# Altium project RK_NVR_DEMO1_RK3588_LP4XD200P232SD8_V21_20211228.PrjPcb (part 12 of 19)

## Sheet 55.VO-HDMI1.4 TX(MIPI to HDMI).SchDoc
size 420 x 297 mm; Revision: V2.1; Schematic Page Number: 11; Page Number: 30; Check: Default; Schematic Name: RK_NVR_DEMO1_RK3588_LP4/4x_V21; Page Count: 43; Page name: 55.VO-HDMI1.4 TX(MIPI to HDMI); Designer: Zhangdz; Schematic Page Count: 99; Revcode: V2.1; DsnPath: E:\Work\SBER\RK3588_SOM\temp\RK_NVR_DEMO1_RK3588_LP4XD200P232SD8_V21_20211228.DSN; SchematicName: RK_NVR_DEMO1_RK3588_LP4/4x_V21; PageName: 55.VO-HDMI1.4 TX(MIPI to HDMI); PageSize: A3; TopSchematic: True
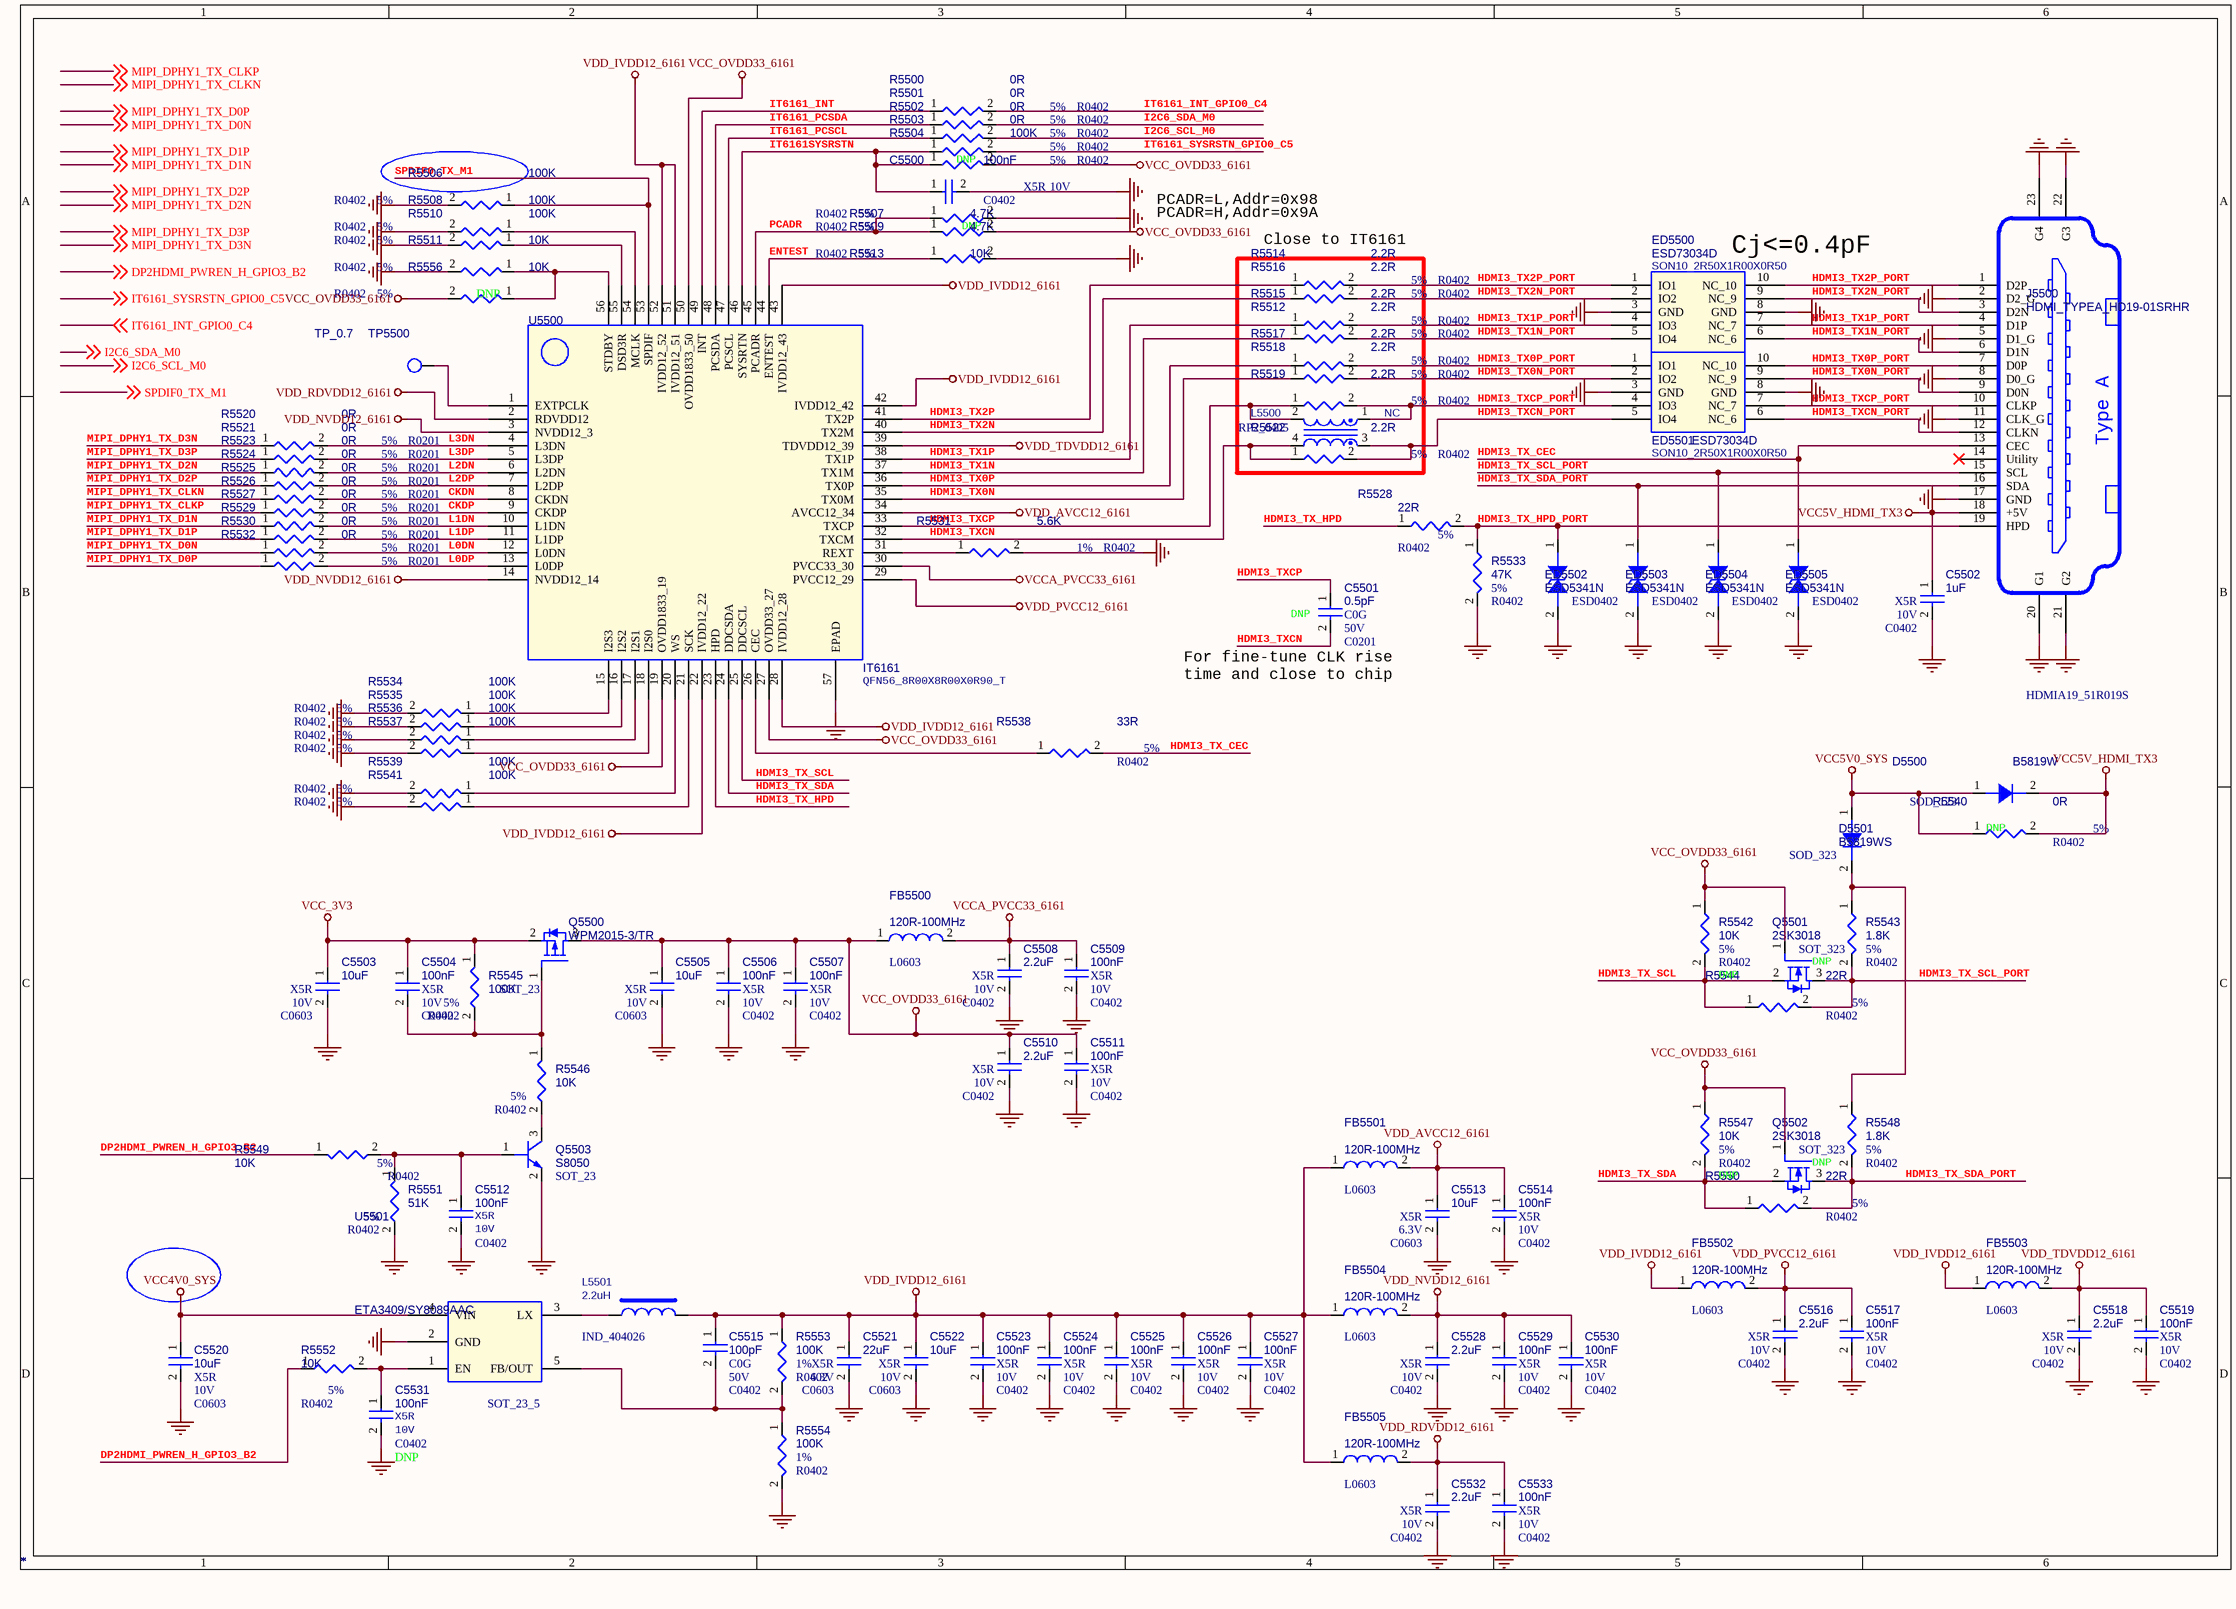
[diagram p57: 55.VO-HDMI1.4 TX(MIPI to HDMI).SchDoc]

### Parts
C5500  *  Voltage: 10V  Dielectric: X5R  [C0402]
C5501  *  Voltage: 50V  Dielectric: C0G  Option: DNP  [C0201]
C5502  *  Voltage: 10V  Dielectric: X5R  [C0402]
C5503  *  Voltage: 10V  Dielectric: X5R  [C0603]
C5504  *  Voltage: 10V  Dielectric: X5R  [C0402]
C5505  *  Voltage: 10V  Dielectric: X5R  [C0603]
C5506  *  Voltage: 10V  Dielectric: X5R  [C0402]
C5507  *  Voltage: 10V  Dielectric: X5R  [C0402]
C5508  *  Voltage: 10V  Dielectric: X5R  [C0402]
C5509  *  Voltage: 10V  Dielectric: X5R  [C0402]
C5510  *  Voltage: 10V  Dielectric: X5R  [C0402]
C5511  *  Voltage: 10V  Dielectric: X5R  [C0402]
C5512  *  Voltage: 10V  Dielectric: X5R  [C0402]
C5513  *  Voltage: 6.3V  Dielectric: X5R  [C0603]
C5514  *  Voltage: 10V  Dielectric: X5R  [C0402]
C5515  *  Voltage: 50V  Dielectric: C0G  [C0402]
C5516  *  Voltage: 10V  Dielectric: X5R  [C0402]
C5517  *  Voltage: 10V  Dielectric: X5R  [C0402]
C5518  *  Voltage: 10V  Dielectric: X5R  [C0402]
C5519  *  Voltage: 10V  Dielectric: X5R  [C0402]
C5520  *  Voltage: 10V  Dielectric: X5R  [C0603]
C5521  *  Voltage: 6.3V  Dielectric: X5R  [C0603]
C5522  *  Voltage: 10V  Dielectric: X5R  [C0603]
C5523  *  Voltage: 10V  Dielectric: X5R  [C0402]
C5524  *  Voltage: 10V  Dielectric: X5R  [C0402]
C5525  *  Voltage: 10V  Dielectric: X5R  [C0402]
C5526  *  Voltage: 10V  Dielectric: X5R  [C0402]
C5527  *  Voltage: 10V  Dielectric: X5R  [C0402]
C5528  *  Voltage: 10V  Dielectric: X5R  [C0402]
C5529  *  Voltage: 10V  Dielectric: X5R  [C0402]
C5530  *  Voltage: 10V  Dielectric: X5R  [C0402]
C5531  *  Voltage: 10V  Dielectric: X5R  option: DNP  [C0402]
C5532  *  Voltage: 10V  Dielectric: X5R  [C0402]
C5533  *  Voltage: 10V  Dielectric: X5R  [C0402]
D5500  *  [SOD_123]
D5501  *  [SOD_323]
ED5500  *  [SON10_2R50X1R00X0R50]
ED5501  *  [SON10_2R50X1R00X0R50]
ED5502  *  [ESD0402]
ED5503  *  [ESD0402]
ED5504  *  [ESD0402]
ED5505  *  [ESD0402]
FB5500  *  [L0603]
FB5501  *  [L0603]
FB5502  *  [L0603]
FB5503  *  [L0603]
FB5504  *  [L0603]
FB5505  *  [L0603]
J5500  *  [HDMIA19_51R019S]
L5500  *  PCB Footprint: RP2_0405  [L0402D]
L5501  *  [IND_404026]
Q5500  *  PCB Footprint: SOT_23  [SOT23]
Q5501  *  PCB Footprint: SOT_323  Option: DNP  [SOT23]
Q5502  *  PCB Footprint: SOT_323  Option: DNP  [SOT23]
Q5503  *  [SOT_23]
R5500  *  Tolerance: 5%  [R0402]
R5501  *  Tolerance: 5%  [R0402]
R5502  *  Tolerance: 5%  [R0402]
R5503  *  Tolerance: 5%  [R0402]
R5504  *  Tolerance: 5%  Option: DNP  [R0402]
R5506  *  Tolerance: 5%  [R0402]
R5507  *  Tolerance: 5%  [R0402]
R5508  *  Tolerance: 5%  [R0402]
R5509  *  Tolerance: 5%  option: DNP  [R0402]
R5510  *  Tolerance: 5%  [R0402]
R5511  *  Tolerance: 5%  [R0402]
R5512  *  Tolerance: 5%  [R0402]
R5513  *  Tolerance: 5%  [R0402]
R5514  *  Tolerance: 5%  [R0402]
R5515  *  Tolerance: 5%  [R0402]
R5516  *  Tolerance: 5%  [R0402]
R5517  *  Tolerance: 5%  [R0402]
R5518  *  Tolerance: 5%  [R0402]
R5519  *  Tolerance: 5%  [R0402]
R5520  *  PCB Footprint: R0201  Tolerance: 5%  [R0402]
R5521  *  PCB Footprint: R0201  Tolerance: 5%  [R0402]
R5522  *  Tolerance: 5%  [R0402]
R5523  *  PCB Footprint: R0201  Tolerance: 5%  [R0402]
R5524  *  PCB Footprint: R0201  Tolerance: 5%  [R0402]
R5525  *  PCB Footprint: R0201  Tolerance: 5%  [R0402]
R5526  *  PCB Footprint: R0201  Tolerance: 5%  [R0402]
R5527  *  PCB Footprint: R0201  Tolerance: 5%  [R0402]
R5528  *  Tolerance: 5%  [R0402]
R5529  *  PCB Footprint: R0201  Tolerance: 5%  [R0402]
R5530  *  PCB Footprint: R0201  Tolerance: 5%  [R0402]
R5531  *  Tolerance: 1%  [R0402]
R5532  *  PCB Footprint: R0201  Tolerance: 5%  [R0402]
R5533  *  Tolerance: 5%  [R0402]
R5534  *  Tolerance: 5%  [R0402]
R5535  *  Tolerance: 5%  [R0402]
R5536  *  Tolerance: 5%  [R0402]
R5537  *  Tolerance: 5%  [R0402]
R5538  *  Tolerance: 5%  [R0402]
R5539  *  Tolerance: 5%  [R0402]
R5540  *  Tolerance: 5%  Option: DNP  [R0402]
R5541  *  Tolerance: 5%  [R0402]
R5542  *  Tolerance: 5%  Option: DNP  [R0402]
R5543  *  Tolerance: 5%  [R0402]
R5544  *  Tolerance: 5%  [R0402]
R5545  *  Tolerance: 5%  [R0402]
R5546  *  Tolerance: 5%  [R0402]
R5547  *  Tolerance: 5%  Option: DNP  [R0402]
R5548  *  Tolerance: 5%  [R0402]
R5549  *  Tolerance: 5%  [R0402]
R5550  *  Tolerance: 5%  [R0402]
R5551  *  Tolerance: 5%  [R0402]
R5552  *  Tolerance: 5%  [R0402]
R5553  *  Tolerance: 1%  [R0402]
R5554  *  Tolerance: 1%  [R0402]
R5556  *  Tolerance: 5%  option: DNP  [R0402]
TP5500  *  [TEST]
U5500  *  PCB Footprint: QFN56_8R00X8R00X0R90_T  [QFN56]
U5501  *  [SOT_23_5]

### Blocks framed on the sheet
Close to IT6161: L5500 R5512 R5514-R5519 R5522

### Nets
GND: C5500.2 C5502.2 C5503.2 C5505.2 C5506.2 C5507.2 C5508.2 C5509.2 C5510.2 C5511.2 C5512.2 C5513.2 C5514.2 C5516.2 C5517.2 C5518.2 C5519.2 C5520.2 C5521.2 C5522.2 C5523.2 C5524.2 C5525.2 C5526.2 C5527.2 C5528.2 C5529.2 C5530.2 C5531.2 C5532.2 C5533.2 ED5500.3(GND) ED5500.8(GND) ED5501.3(GND) ED5501.8(GND) ED5502.2 ED5503.2 ED5504.2 ED5505.2 J5500.2(D2_G) J5500.5(D1_G) J5500.8(D0_G) J5500.11(CLK_G) J5500.17(GND) J5500.20(G1) J5500.21(G2) J5500.22(G3) J5500.23(G4) Q5503.2(EMITTER) R5506.2 R5507.2 R5508.2 R5510.2 R5511.2 R5513.2 R5531.2 R5533.2 R5534.2 R5535.2 R5536.2 R5537.2 R5539.2 R5541.2 R5551.2 R5554.2 U5500.57(EPAD) U5501.2(GND)
VCC4V0_SYS: C5520.1 U5501.4(VIN)
VCC5V0_SYS: D5500.1(A) D5501.1(A) R5540.1
VCC5V_HDMI_TX3: C5502.1 D5500.2(K) J5500.18(+5V) R5540.2
VCC_3V3: C5503.1 C5504.1 Q5500.2(SOURCE) R5545.1
VCC_OVDD33_6161: C5505.1 C5506.1 C5507.1 C5510.1 C5511.1 FB5500.1 Q5500.3(DRAIN) Q5501.1(GATE) Q5502.1(GATE) R5504.2 R5509.2 R5542.1 R5547.1 R5556.2 U5500.19(OVDD1833_19) U5500.27(OVDD33_27) U5500.50(OVDD1833_50)
VCCA_PVCC33_6161: C5508.1 C5509.1 FB5500.2 U5500.30(PVCC33_30)
VDD_AVCC12_6161: C5513.1 C5514.1 FB5501.2 U5500.34(AVCC12_34)
VDD_IVDD12_6161: C5515.1 C5521.1 C5522.1 C5523.1 C5524.1 C5525.1 C5526.1 C5527.1 FB5501.1 FB5502.1 FB5503.1 FB5504.1 FB5505.1 L5501.2 R5553.1 U5500.22(IVDD12_22) U5500.28(IVDD12_28) U5500.42(IVDD12_42) U5500.43(IVDD12_43) U5500.51(IVDD12_51) U5500.52(IVDD12_52)
VDD_NVDD12_6161: C5528.1 C5529.1 C5530.1 FB5504.2 U5500.3(NVDD12_3) U5500.14(NVDD12_14)
VDD_PVCC12_6161: C5516.1 C5517.1 FB5502.2 U5500.29(PVCC12_29)
VDD_RDVDD12_6161: C5532.1 C5533.1 FB5505.2 U5500.2(RDVDD12)
VDD_TDVDD12_6161: C5518.1 C5519.1 FB5503.2 U5500.39(TDVDD12_39)
CKDN: R5525.2 U5500.8(CKDN)
CKDP: R5526.2 U5500.9(CKDP)
DP2HDMI_PWREN_H_GPIO3_B2: R5549.1 R5552.1 ; off-sheet DP2HDMI_PWREN_H_GPIO3_B2
ENTEST: R5513.1 U5500.44(ENTEST)
HDMI3_TX0N: R5518.1 U5500.35(TX0M)
HDMI3_TX0N_PORT: ED5501.2(IO2) ED5501.9(NC_9) J5500.9(D0N) R5518.2
HDMI3_TX0P: R5517.1 U5500.36(TX0P)
HDMI3_TX0P_PORT: ED5501.1(IO1) ED5501.10(NC_10) J5500.7(D0P) R5517.2
HDMI3_TX1N: R5512.1 U5500.37(TX1M)
HDMI3_TX1N_PORT: ED5500.5(IO4) ED5500.6(NC_6) J5500.6(D1N) R5512.2
HDMI3_TX1P: R5515.1 U5500.38(TX1P)
HDMI3_TX1P_PORT: ED5500.4(IO3) ED5500.7(NC_7) J5500.4(D1P) R5515.2
HDMI3_TX2N: R5516.1 U5500.40(TX2M)
HDMI3_TX2N_PORT: ED5500.2(IO2) ED5500.9(NC_9) J5500.3(D2N) R5516.2
HDMI3_TX2P: R5514.1 U5500.41(TX2P)
HDMI3_TX2P_PORT: ED5500.1(IO1) ED5500.10(NC_10) J5500.1(D2P) R5514.2
HDMI3_TX_CEC: ED5505.1 J5500.13(CEC) R5538.2
HDMI3_TX_HPD: R5528.1 U5500.23(HPD)
HDMI3_TX_HPD_PORT: ED5502.1 J5500.19(HPD) R5528.2 R5533.1
HDMI3_TX_SCL: Q5501.2(SOURCE) R5542.2 R5544.1 U5500.25(DDCSCL)
HDMI3_TX_SCL_PORT: ED5504.1 J5500.15(SCL) Q5501.3(DRAIN) R5543.2 R5544.2
HDMI3_TX_SDA: Q5502.2(SOURCE) R5547.2 R5550.1 U5500.24(DDCSDA)
HDMI3_TX_SDA_PORT: ED5503.1 J5500.16(SDA) Q5502.3(DRAIN) R5548.2 R5550.2
HDMI3_TXCN: C5501.2 L5500.4 R5522.1 U5500.32(TXCM)
HDMI3_TXCN_PORT: ED5501.5(IO4) ED5501.6(NC_6) J5500.12(CLKN) L5500.3 R5522.2
HDMI3_TXCP: C5501.1 L5500.2 R5519.1 U5500.33(TXCP)
HDMI3_TXCP_PORT: ED5501.4(IO3) ED5501.7(NC_7) J5500.10(CLKP) L5500.1 R5519.2
I2C6_SCL_M0: R5502.2 ; off-sheet I2C6_SCL_M0
I2C6_SDA_M0: R5501.2 ; off-sheet I2C6_SDA_M0
IT6161_INT: R5500.1 U5500.49(INT)
IT6161_INT_GPIO0_C4: R5500.2 ; off-sheet IT6161_INT_GPIO0_C4
IT6161_PCSCL: R5502.1 U5500.47(PCSCL)
IT6161_PCSDA: R5501.1 U5500.48(PCSDA)
IT6161_SYSRSTN_GPIO0_C5: R5503.2 ; off-sheet IT6161_SYSRSTN_GPIO0_C5
IT6161SYSRSTN: C5500.1 R5503.1 R5504.1 U5500.46(SYSRTN)
L0DN: R5530.2 U5500.12(L0DN)
L0DP: R5532.2 U5500.13(L0DP)
L1DN: R5527.2 U5500.10(L1DN)
L1DP: R5529.2 U5500.11(L1DP)
L2DN: R5523.2 U5500.6(L2DN)
L2DP: R5524.2 U5500.7(L2DP)
L3DN: R5520.2 U5500.4(L3DN)
L3DP: R5521.2 U5500.5(L3DP)
MIPI_DPHY1_TX_CLKN: R5525.1 ; off-sheet MIPI_DPHY1_TX_CLKN
MIPI_DPHY1_TX_CLKP: R5526.1 ; off-sheet MIPI_DPHY1_TX_CLKP
MIPI_DPHY1_TX_D0N: R5530.1 ; off-sheet MIPI_DPHY1_TX_D0N
MIPI_DPHY1_TX_D0P: R5532.1 ; off-sheet MIPI_DPHY1_TX_D0P
MIPI_DPHY1_TX_D1N: R5527.1 ; off-sheet MIPI_DPHY1_TX_D1N
MIPI_DPHY1_TX_D1P: R5529.1 ; off-sheet MIPI_DPHY1_TX_D1P
MIPI_DPHY1_TX_D2N: R5523.1 ; off-sheet MIPI_DPHY1_TX_D2N
MIPI_DPHY1_TX_D2P: R5524.1 ; off-sheet MIPI_DPHY1_TX_D2P
MIPI_DPHY1_TX_D3N: R5520.1 ; off-sheet MIPI_DPHY1_TX_D3N
MIPI_DPHY1_TX_D3P: R5521.1 ; off-sheet MIPI_DPHY1_TX_D3P
PCADR: R5507.1 R5509.1 U5500.45(PCADR)
SPDIF0_TX_M1: R5506.1 U5500.53(SPDIF) ; off-sheet SPDIF0_TX_M1
NetC5504_2: C5504.2 Q5500.1(GATE) R5545.2 R5546.1
NetC5512_1: C5512.1 Q5503.1(BASE) R5549.2 R5551.1
NetC5515_2: C5515.2 R5553.2 R5554.1 U5501.5(FB/OUT)
NetC5531_1: C5531.1 R5552.2 U5501.1(EN)
NetD5501_2: D5501.2(K) R5543.1 R5548.1
NetL5501_1: L5501.1 U5501.3(LX)
NetQ5503_3: Q5503.3(COLLECTOR) R5546.2
NetR5508_1: R5508.1 U5500.54(MCLK)
NetR5510_1: R5510.1 U5500.55(DSD3R)
NetR5511_1: R5511.1 R5556.1 U5500.56(STDBY)
NetR5531_1: R5531.1 U5500.31(REXT)
NetR5534_1: R5534.1 U5500.15(I2S3)
NetR5535_1: R5535.1 U5500.16(I2S2)
NetR5536_1: R5536.1 U5500.17(I2S1)
NetR5537_1: R5537.1 U5500.18(I2S0)
NetR5538_1: R5538.1 U5500.26(CEC)
NetR5539_1: R5539.1 U5500.20(WS)
NetR5541_1: R5541.1 U5500.21(SCK)
NetTP5500_1: TP5500.1 U5500.1(EXTPCLK)

Not connected (* = marked no-connect by the designer): J5500 14(Utility)*

### Notes on the sheet
- PCADR=L,Addr=0x98
- PCADR=H,Addr=0x9A
- (near ED5500) Cj<=0.4pF
- (near C5501) For fine-tune CLK rise
  time and close to chip
- (in symbol HDMI_TYPE_A_0) Type A

### Library data of the parts
C5500 = CAP NP: cap,100.00nF,+/-10%,10V,X5R,C0402; Part Reference: C5500; Manufacturer PN: C1005X5R1A104K050BA; Manufacturer: TDK; Value: 100nF; Tolerance: 10%; Priority: A; PCB Footprint: C0402; Created by: JJJ; Part Type: C0402; RK PN: C1005X5R1A104K050BA
C5501 = CAP NP: cap,0.50pF,+/-0.25,50V,C0G,C0201; Part Reference: C5501; Manufacturer: TDK; Value: 0.5pF; RK PN: C0603C0G1H0R5C030BA; Priority: A; Tolerance: +/-0.25pF; PCB Footprint: C0201; Part Type: C0201; Manufacturer PN: C0603C0G1H0R5C030BA; Created by: JJJ
C5502 = CAP NP: cap,1.00uF,+/-10%,10V,X5R,C0402; Part Reference: C5502; Manufacturer: TDK; Value: 1uF; Number: 37; RK PN: C1005X5R1A105K050BB; Priority: A; Tolerance: 10%; PCB Footprint: C0402; Part Type: C0402; Manufacturer PN: C1005X5R1A105K050BB; C_Voltage: 10V; Created by: JJJ
C5503 = CAP NP: cap,10.00uF,+/-10%,10V,X5R,C0603; Part Reference: C5503; Manufacturer PN: C1608X5R1A106K080AC; Manufacturer: TDK; Value: 10uF; Tolerance: 10%; C_Voltage: 6.3V; Priority: A; PCB Footprint: C0603; Created by: JJJ; Part Type: C0603; RK PN: C1608X5R1A106K080AC
C5504 = CAP NP: cap,100.00nF,+/-10%,10V,X5R,C0402; Part Reference: C5504; Manufacturer: TDK; Value: 100nF; Number: 37; RK PN: C1005X5R1A104K050BA; Priority: A; Tolerance: 10%; C_Voltage: 6.3V; PCB Footprint: C0402; Part Type: C0402; Manufacturer PN: C1005X5R1A104K050BA; Created by: JJJ
C5505 = CAP NP: cap,10.00uF,+/-10%,10V,X5R,C0603; Part Reference: C5505; Manufacturer PN: C1608X5R1A106K080AC; Manufacturer: TDK; Value: 10uF; Tolerance: 10%; C_Voltage: 6.3V; Priority: A; PCB Footprint: C0603; Created by: JJJ; Part Type: C0603; RK PN: C1608X5R1A106K080AC
C5506 = CAP NP: cap,100.00nF,+/-10%,10V,X5R,C0402; Part Reference: C5506; Manufacturer: TDK; Value: 100nF; RK PN: C1005X5R1A104K050BA; Priority: A; Tolerance: 10%; PCB Footprint: C0402; Part Type: C0402; Manufacturer PN: C1005X5R1A104K050BA; Created by: JJJ
C5507 = CAP NP: cap,100.00nF,+/-10%,10V,X5R,C0402; Part Reference: C5507; Manufacturer: TDK; Value: 100nF; RK PN: C1005X5R1A104K050BA; Priority: A; Tolerance: 10%; PCB Footprint: C0402; Part Type: C0402; Manufacturer PN: C1005X5R1A104K050BA; Created by: JJJ
C5508 = CAP NP: cap,2.20uF,+/-10%,10V,X5R,C0402; Part Reference: C5508; Manufacturer: TDK; Value: 2.2uF; RK PN: C1005X5R1A225K050BC; Priority: A; C_Voltage: 6.3V; Tolerance: 10%; PCB Footprint: C0402; Part Type: C0402; Manufacturer PN: C1005X5R1A225K050BC; Created by: JJJ
C5509 = CAP NP: cap,100.00nF,+/-10%,10V,X5R,C0402; Part Reference: C5509; Manufacturer: TDK; Value: 100nF; RK PN: C1005X5R1A104K050BA; Priority: A; Tolerance: 10%; PCB Footprint: C0402; Part Type: C0402; Manufacturer PN: C1005X5R1A104K050BA; Created by: JJJ
C5510 = CAP NP: cap,2.20uF,+/-10%,10V,X5R,C0402; Part Reference: C5510; Manufacturer: TDK; Value: 2.2uF; RK PN: C1005X5R1A225K050BC; Priority: A; C_Voltage: 6.3V; Tolerance: 10%; PCB Footprint: C0402; Part Type: C0402; Manufacturer PN: C1005X5R1A225K050BC; Created by: JJJ
C5511 = CAP NP: cap,100.00nF,+/-10%,10V,X5R,C0402; Part Reference: C5511; Manufacturer PN: C1005X5R1A104K050BA; Manufacturer: TDK; Value: 100nF; Tolerance: 10%; Priority: A; PCB Footprint: C0402; Created by: JJJ; Part Type: C0402; RK PN: C1005X5R1A104K050BA
C5512 = CAP NP: cap,100.00nF,+/-10%,10V,X5R,C0402; Part Reference: C5512; Manufacturer PN: C1005X5R1A104K050BA; Manufacturer: TDK; Value: 100nF; Priority: A; Tolerance: 10%; PCB Footprint: C0402; Created by: JJJ; Part Type: C0402; RK PN: C1005X5R1A104K050BA
C5513 = CAP NP: cap,10.00uF,+/-10%,6.3V,X5R,C0603; Part Reference: C5513; Manufacturer PN: C1608X5R0J106K080AB; Manufacturer: TDK; Value: 10uF; Tolerance: 10%; Priority: A; PCB Footprint: C0603; Created by: JJJ; C_Voltage: 6.3V; Part Type: C0603; RK PN: C1608X5R0J106K080AB
C5514 = CAP NP: cap,100.00nF,+/-10%,10V,X5R,C0402; Part Reference: C5514; Manufacturer PN: C1005X5R1A104K050BA; Manufacturer: TDK; Value: 100nF; Tolerance: 10%; Priority: A; PCB Footprint: C0402; Created by: JJJ; Part Type: C0402; RK PN: C1005X5R1A104K050BA
C5515 = CAP NP: cap,100.00pF,+/-10%,50V,C0G,C0402; Part Reference: C5515; Manufacturer: TDK; Value: 100pF; RK PN: C1005C0G1H101K050BA; Priority: A; Tolerance: 10%; PCB Footprint: C0402; Part Type: C0402; Manufacturer PN: C1005C0G1H101K050BA; Created by: JJJ
C5516 = CAP NP: cap,2.20uF,+/-10%,10V,X5R,C0402; Part Reference: C5516; Manufacturer: TDK; Value: 2.2uF; RK PN: C1005X5R1A225K050BC; Priority: A; C_Voltage: 6.3V; Tolerance: 10%; PCB Footprint: C0402; Part Type: C0402; Manufacturer PN: C1005X5R1A225K050BC; Created by: JJJ
C5517 = CAP NP: cap,100.00nF,+/-10%,10V,X5R,C0402; Part Reference: C5517; Manufacturer: TDK; Value: 100nF; RK PN: C1005X5R1A104K050BA; Priority: A; Tolerance: 10%; PCB Footprint: C0402; Part Type: C0402; Manufacturer PN: C1005X5R1A104K050BA; Created by: JJJ
C5518 = CAP NP: cap,2.20uF,+/-10%,10V,X5R,C0402; Part Reference: C5518; Manufacturer: TDK; Value: 2.2uF; RK PN: C1005X5R1A225K050BC; Priority: A; C_Voltage: 6.3V; Tolerance: 10%; PCB Footprint: C0402; Part Type: C0402; Manufacturer PN: C1005X5R1A225K050BC; Created by: JJJ
C5519 = CAP NP: cap,100.00nF,+/-10%,10V,X5R,C0402; Part Reference: C5519; Manufacturer: TDK; Value: 100nF; RK PN: C1005X5R1A104K050BA; Priority: A; Tolerance: 10%; PCB Footprint: C0402; Part Type: C0402; Manufacturer PN: C1005X5R1A104K050BA; Created by: JJJ
C5520 = CAP NP: cap,10.00uF,+/-10%,10V,X5R,C0603; Part Reference: C5520; Manufacturer: TDK; Value: 10uF; RK PN: C1608X5R1A106K080AC; Priority: A; Tolerance: 10%; PCB Footprint: C0603; Part Type: C0603; Manufacturer PN: C1608X5R1A106K080AC; Created by: JJJ
C5521 = CAP NP: cap,22.00uF,+/-20%,6.3V,X5R,C0603; Part Reference: C5521; Manufacturer: TDK; Value: 22uF; RK PN: C1608X5R0J226M080AC; Priority: A; Tolerance: 20%; PCB Footprint: C0603; Part Type: C0603; C_Voltage: 6.3V; Manufacturer PN: C1608X5R0J226M080AC; Created by: JJJ
C5522 = CAP NP: cap,10.00uF,+/-10%,10V,X5R,C0603; Part Reference: C5522; Manufacturer PN: C1608X5R1A106K080AC; Manufacturer: TDK; Value: 10uF; Tolerance: 10%; C_Voltage: 6.3V; Priority: A; PCB Footprint: C0603; Created by: JJJ; Part Type: C0603; RK PN: C1608X5R1A106K080AC
C5523 = CAP NP: cap,100.00nF,+/-10%,10V,X5R,C0402; Part Reference: C5523; Manufacturer PN: C1005X5R1A104K050BA; Manufacturer: TDK; Value: 100nF; Tolerance: 10%; Priority: A; PCB Footprint: C0402; Created by: JJJ; Part Type: C0402; RK PN: C1005X5R1A104K050BA
C5524 = CAP NP: cap,100.00nF,+/-10%,10V,X5R,C0402; Part Reference: C5524; Manufacturer PN: C1005X5R1A104K050BA; Manufacturer: TDK; Value: 100nF; Tolerance: 10%; Priority: A; PCB Footprint: C0402; Created by: JJJ; Part Type: C0402; RK PN: C1005X5R1A104K050BA
C5525 = CAP NP: cap,100.00nF,+/-10%,10V,X5R,C0402; Part Reference: C5525; Manufacturer: TDK; Value: 100nF; RK PN: C1005X5R1A104K050BA; Priority: A; Tolerance: 10%; PCB Footprint: C0402; Part Type: C0402; Manufacturer PN: C1005X5R1A104K050BA; Created by: JJJ
C5526 = CAP NP: cap,100.00nF,+/-10%,10V,X5R,C0402; Part Reference: C5526; Manufacturer PN: C1005X5R1A104K050BA; Manufacturer: TDK; Value: 100nF; Tolerance: 10%; Priority: A; PCB Footprint: C0402; Created by: JJJ; Part Type: C0402; RK PN: C1005X5R1A104K050BA
C5527 = CAP NP: cap,100.00nF,+/-10%,10V,X5R,C0402; Part Reference: C5527; Manufacturer PN: C1005X5R1A104K050BA; Manufacturer: TDK; Value: 100nF; Tolerance: 10%; Priority: A; PCB Footprint: C0402; Created by: JJJ; Part Type: C0402; RK PN: C1005X5R1A104K050BA
C5528 = CAP NP: cap,2.20uF,+/-10%,10V,X5R,C0402; Part Reference: C5528; Manufacturer: TDK; Value: 2.2uF; RK PN: C1005X5R1A225K050BC; Priority: A; C_Voltage: 6.3V; Tolerance: 10%; PCB Footprint: C0402; Part Type: C0402; Manufacturer PN: C1005X5R1A225K050BC; Created by: JJJ
C5529 = CAP NP: cap,100.00nF,+/-10%,10V,X5R,C0402; Part Reference: C5529; Manufacturer PN: C1005X5R1A104K050BA; Manufacturer: TDK; Value: 100nF; Tolerance: 10%; Priority: A; PCB Footprint: C0402; Created by: JJJ; Part Type: C0402; RK PN: C1005X5R1A104K050BA
C5530 = CAP NP: cap,100.00nF,+/-10%,10V,X5R,C0402; Part Reference: C5530; Manufacturer: TDK; Value: 100nF; RK PN: C1005X5R1A104K050BA; Priority: A; Tolerance: 10%; PCB Footprint: C0402; Part Type: C0402; Manufacturer PN: C1005X5R1A104K050BA; Created by: JJJ
C5531 = CAP NP: cap,100.00nF,+/-10%,10V,X5R,C0402; Part Reference: C5531; Manufacturer PN: C1005X5R1A104K050BA; Manufacturer: TDK; Value: 100nF; Priority: A; Tolerance: 10%; PCB Footprint: C0402; Created by: JJJ; Part Type: C0402; RK PN: C1005X5R1A104K050BA
C5532 = CAP NP: cap,2.20uF,+/-10%,10V,X5R,C0402; Part Reference: C5532; Manufacturer PN: C1005X5R1A225K050BC; Manufacturer: TDK; Value: 2.2uF; Tolerance: 10%; C_Voltage: 6.3V; Priority: A; PCB Footprint: C0402; Created by: JJJ; Part Type: C0402; RK PN: C1005X5R1A225K050BC
C5533 = CAP NP: cap,100.00nF,+/-10%,10V,X5R,C0402; Part Reference: C5533; Manufacturer PN: C1005X5R1A104K050BA; Manufacturer: TDK; Value: 100nF; Tolerance: 10%; Priority: A; PCB Footprint: C0402; Created by: JJJ; Part Type: C0402; RK PN: C1005X5R1A104K050BA
D5500 = DIODE: Schottky BarrierЈ¬B5819W SOD-123; Part Reference: D5500; Manufacturer: і¤µз; Value: B5819W; Priority: A; PCB Footprint: SOD_123; Created by: JJJ; Manufacturer PN: B5819W; Part Type: Schottky rectifier; RK PN: B5819W
D5501 = DIODE: Schottky BarrierЈ¬B5819WS SOD-323; Part Reference: D5501; Manufacturer: і¤µз; Priority: A; PCB Footprint: SOD_323; Value: B5819WS; Created by: JJJ; Manufacturer PN: B5819WS; Part Type: Schottky rectifier; RK PN: B5819WS
ED5500 = ESD_ESD5304D: 4-Lines, Uni-directional, Ultra-low Capacitance Transient Voltage Suppressors; Part Reference: ED5500; Manufacturer: WillSemi(О¤¶ы°лµјМе); Value: ESD73034D; Priority: A; PCB Footprint: SON10_2R50X1R00X0R50; RK PN: ESD5304D; Part Type: ESD_TVS; Manufacturer PN: ESD5304D; Created by: JJJ
ED5501 = ESD_ESD5304D: 4-Lines, Uni-directional, Ultra-low Capacitance Transient Voltage Suppressors; Part Reference: ED5501; Manufacturer: WillSemi(О¤¶ы°лµјМе); Value: ESD73034D; Priority: A; PCB Footprint: SON10_2R50X1R00X0R50; Created by: JJJ; Manufacturer PN: ESD5304D; Part Type: ESD_TVS; RK PN: ESD5304D
ED5502 = DIODE BI_DIR TRIG: 1-Line, Bi-directional, Transient Voltage Suppressors.1pF.; Part Reference: ED5502; Manufacturer: WillSemi(О¤¶ы°лµјМе); Value: ESD5341N; Priority: A; PCB Footprint: ESD0402; RK PN: ESD5341N; Part Type: ESD_TVS; Manufacturer PN: ESD5341N; Created by: JJJ
ED5503 = DIODE BI_DIR TRIG: 1-Line, Bi-directional, Transient Voltage Suppressors.1pF.; Part Reference: ED5503; Manufacturer: WillSemi(О¤¶ы°лµјМе); Value: ESD5341N; Priority: A; PCB Footprint: ESD0402; Created by: JJJ; Manufacturer PN: ESD5341N; Part Type: ESD_TVS; RK PN: ESD5341N
ED5504 = DIODE BI_DIR TRIG: 1-Line, Bi-directional, Transient Voltage Suppressors.1pF.; Part Reference: ED5504; Manufacturer: WillSemi(О¤¶ы°лµјМе); Value: ESD5341N; Priority: A; PCB Footprint: ESD0402; Created by: JJJ; Manufacturer PN: ESD5341N; Part Type: ESD_TVS; RK PN: ESD5341N
ED5505 = DIODE BI_DIR TRIG: 1-Line, Bi-directional, Transient Voltage Suppressors.1pF.; Part Reference: ED5505; Manufacturer: WillSemi(О¤¶ы°лµјМе); Value: ESD5341N; Priority: A; PCB Footprint: ESD0402; Created by: JJJ; Manufacturer PN: ESD5341N; Part Type: ESD_TVS; RK PN: ESD5341N
FB5500 = BEAD: BEAD,120R@100MHz,current=2000mA,0603; Part Reference: FB5500; Manufacturer: Murata; DC Resistor: 0.030ohm; Tolerance: 25%; Irms: 2A; Value: 120R-100MHz; RK PN: BLM18KG121TN1; Priority: L; PCB Footprint: L0603; Part Type: BEAD; Manufacturer PN: BLM18KG121TN1; Created by: DZS
FB5501 = BEAD: BEAD,120R@100MHz,current=2000mA,0603; Part Reference: FB5501; Manufacturer: Murata; DC Resistor: 0.030ohm; Tolerance: 25%; Irms: 2A; Value: 120R-100MHz; RK PN: BLM18KG121TN1; Priority: L; PCB Footprint: L0603; Part Type: BEAD; Manufacturer PN: BLM18KG121TN1; Created by: DZS
FB5502 = BEAD: BEAD,120R@100MHz,current=2000mA,0603; Part Reference: FB5502; Manufacturer PN: BLM18KG121TN1; Manufacturer: Murata; DC Resistor: 0.030ohm; Tolerance: 25%; Irms: 2A; Value: 120R-100MHz; Priority: L; PCB Footprint: L0603; Created by: DZS; Part Type: BEAD; RK PN: BLM18KG121TN1
FB5503 = BEAD: BEAD,120R@100MHz,current=2000mA,0603; Part Reference: FB5503; Manufacturer PN: BLM18KG121TN1; Manufacturer: Murata; DC Resistor: 0.030ohm; Tolerance: 25%; Irms: 2A; Value: 120R-100MHz; Priority: L; PCB Footprint: L0603; Created by: DZS; Part Type: BEAD; RK PN: BLM18KG121TN1
FB5504 = BEAD: BEAD,120R@100MHz,current=2000mA,0603; Part Reference: FB5504; Manufacturer PN: BLM18KG121TN1; Manufacturer: Murata; DC Resistor: 0.030ohm; Tolerance: 25%; Irms: 2A; Value: 120R-100MHz; Priority: L; PCB Footprint: L0603; Created by: DZS; Part Type: BEAD; RK PN: BLM18KG121TN1
FB5505 = BEAD: BEAD,120R@100MHz,current=2000mA,0603; Part Reference: FB5505; Manufacturer: Murata; DC Resistor: 0.030ohm; Tolerance: 25%; Irms: 2A; Value: 120R-100MHz; RK PN: BLM18KG121TN1; Priority: L; PCB Footprint: L0603; Part Type: BEAD; Manufacturer PN: BLM18KG121TN1; Created by: DZS
J5500 = HDMI_TYPE_A_0: Part Reference: J5500; Value: HDMI_TYPEA_HD19-01SRHR; PCB Footprint: HDMIA19_51R019S
L5500 = INDUCTOR COM: Winding Type Common Mode Choke Coil; Part Reference: L5500; Manufacturer PN: SDCW2012-2-900TF; Manufacturer: sunlord; Value: NC; Resonace frequency: 90R@100M; Irms: 330mA; Tolerance: 25%; DC Resistor: 0.35ohm; Priority: A; Created by: JJJ; Part Type: IND; RK PN: SDCW2012-2-900TF
L5501 = INDUCTORS OF FERRITE_Dup1: Power Inductor,2.2uH,0.2,IND_404026; Part Reference: L5501; Manufacturer PN: SWPA4026S2R2MT; Manufacturer: sunlord; Isat: 2.10A; DC Resistor: 0.04ohm; Resonace frequency: 96M; Irms: 2A; Tolerance: 20%; Priority: A; PCB Footprint: IND_404026; Value: 2.2uH; Created by: YTL; Part Type: POWER_IND; RK PN: SWPA4026S2R2MT
Q5500 = MOSFET P: PMOS,WPM2015-3/TR,SOT_23,Id=2.4A,Vds=20V; Part Reference: Q5500; Manufacturer: WillSemi(О¤¶ы°лµјМе); Priority: A; Id_max: 2.4A; Vgs: ЎА8V; VDS: 20V; Vgsth: 0.62V; Pd: 0.5W; Value: WPM2015-3/TR; RK PN: WPM2015-3/TR; Part Type: PMOS; Manufacturer PN: WPM2015-3/TR; Created by: JJJ
Q5501 = MOSFET N: NMOS,2SK3018,SOT_323,Id=0.1A,Vds=30V; Part Reference: Q5501; Manufacturer: ROHM; Rds: 5ohm; Priority: A; Id_max: 0.1A; Vgs: 20V; VDS: 30V; Vgsth: 1.5V; Pd: 0.2W; Value: 2SK3018; RK PN: 2SK3018; Part Type: NMOS; Manufacturer PN: 2SK3018; Created by: JJJ
Q5502 = MOSFET N: NMOS,2SK3018,SOT_323,Id=0.1A,Vds=30V; Part Reference: Q5502; Manufacturer: ROHM; Rds: 5ohm; Priority: A; Id_max: 0.1A; Vgs: 20V; VDS: 30V; Vgsth: 1.5V; Pd: 0.2W; Value: 2SK3018; RK PN: 2SK3018; Part Type: NMOS; Manufacturer PN: 2SK3018; Created by: JJJ
Q5503 = NPN: S8050,SOT23; Part Reference: Q5503; Manufacturer PN: S8050_SOT23; Manufacturer: і¤µз; Pc: 0.3W; Vceo: 25V; Ic: 0.5A; Priority: A; PCB Footprint: SOT_23; Value: S8050; Created by: JJJ; Part Type: NPN; RK PN: S8050
R5500 = RESISTOR_Dup1: НЁУГєсД¤µзЧи,0R,+/-5%,R0402,1/16W.; Part Reference: R5500; Manufacturer: YAGEO; RK PN: RC0402JR-070RL; Priority: A; Wattage: 1/16W; PCB Footprint: R0402; Value: 0R; Part Type: НЁУГєсД¤µзЧи; Manufacturer PN: RC0402JR-070RL; Created by: YTL
R5501 = RESISTOR_Dup1: НЁУГєсД¤µзЧи,0R,+/-5%,R0402,1/16W.; Part Reference: R5501; Manufacturer: YAGEO; RK PN: RC0402JR-070RL; Priority: A; Wattage: 1/16W; PCB Footprint: R0402; Value: 0R; Part Type: НЁУГєсД¤µзЧи; Manufacturer PN: RC0402JR-070RL; Created by: YTL
R5502 = RESISTOR_Dup1: НЁУГєсД¤µзЧи,0R,+/-5%,R0402,1/16W.; Part Reference: R5502; Manufacturer: YAGEO; RK PN: RC0402JR-070RL; Priority: A; Wattage: 1/16W; PCB Footprint: R0402; Value: 0R; Part Type: НЁУГєсД¤µзЧи; Manufacturer PN: RC0402JR-070RL; Created by: YTL
R5503 = RESISTOR_Dup1: НЁУГєсД¤µзЧи,0R,+/-5%,R0402,1/16W.; Part Reference: R5503; Manufacturer: YAGEO; RK PN: RC0402JR-070RL; Priority: A; Wattage: 1/16W; PCB Footprint: R0402; Value: 0R; Part Type: НЁУГєсД¤µзЧи; Manufacturer PN: RC0402JR-070RL; Created by: YTL
R5504 = RESISTOR_Dup1: НЁУГєсД¤µзЧи,100K,+/-5%,R0402,1/16W.; Part Reference: R5504; Manufacturer PN: RC0402JR-07100KL; Manufacturer: YAGEO; Wattage: 1/16W; Priority: A; PCB Footprint: R0402; Value: 100K; Created by: YTL; Part Type: НЁУГєсД¤µзЧи; RK PN: RC0402JR-07100KL
R5506 = RESISTOR_Dup1: НЁУГєсД¤µзЧи,100K,+/-5%,R0402,1/16W.; Part Reference: R5506; Manufacturer PN: RC0402JR-07100KL; Manufacturer: YAGEO; Wattage: 1/16W; Priority: A; PCB Footprint: R0402; Value: 100K; Created by: YTL; Part Type: НЁУГєсД¤µзЧи; RK PN: RC0402JR-07100KL
R5507 = RESISTOR_Dup1: НЁУГєсД¤µзЧи,4K7,+/-5%,R0402,1/16W.; Part Reference: R5507; Manufacturer PN: RC0402JR-074K7L; Manufacturer: YAGEO; Value: 4.7K; Wattage: 1/16W; Priority: A; PCB Footprint: R0402; Created by: YTL; Part Type: НЁУГєсД¤µзЧи; RK PN: RC0402JR-074K7L
R5508 = RESISTOR_Dup1: НЁУГєсД¤µзЧи,100K,+/-5%,R0402,1/16W.; Part Reference: R5508; Manufacturer PN: RC0402JR-07100KL; Manufacturer: YAGEO; Wattage: 1/16W; Priority: A; PCB Footprint: R0402; Value: 100K; Created by: YTL; Part Type: НЁУГєсД¤µзЧи; RK PN: RC0402JR-07100KL
R5509 = RESISTOR_Dup1: НЁУГєсД¤µзЧи,4K7,+/-5%,R0402,1/16W.; Part Reference: R5509; Manufacturer: YAGEO; Value: 4.7K; RK PN: RC0402JR-074K7L; Priority: A; Wattage: 1/16W; PCB Footprint: R0402; Part Type: НЁУГєсД¤µзЧи; Manufacturer PN: RC0402JR-074K7L; Created by: YTL
R5510 = RESISTOR_Dup1: НЁУГєсД¤µзЧи,100K,+/-5%,R0402,1/16W.; Part Reference: R5510; Manufacturer PN: RC0402JR-07100KL; Manufacturer: YAGEO; Wattage: 1/16W; Priority: A; PCB Footprint: R0402; Value: 100K; Created by: YTL; Part Type: НЁУГєсД¤µзЧи; RK PN: RC0402JR-07100KL
R5511 = RESISTOR_Dup1: НЁУГєсД¤µзЧи,10K,+/-5%,R0402,1/16W.; Part Reference: R5511; Manufacturer PN: RC0402JR-0710KL; Manufacturer: YAGEO; Wattage: 1/16W; Priority: A; PCB Footprint: R0402; Value: 10K; Created by: YTL; Part Type: НЁУГєсД¤µзЧи; RK PN: RC0402JR-0710KL
R5512 = RESISTOR_Dup1: НЁУГєсД¤µзЧи,2R2,+/-5%,R0402,1/16W.; Part Reference: R5512; Manufacturer PN: RC0402JR-072R2L; Manufacturer: YAGEO; Value: 2.2R; Wattage: 1/16W; Priority: A; PCB Footprint: R0402; Created by: YTL; Part Type: НЁУГєсД¤µзЧи; RK PN: RC0402JR-072R2L
R5513 = RESISTOR_Dup1: НЁУГєсД¤µзЧи,10K,+/-5%,R0402,1/16W.; Part Reference: R5513; Manufacturer: YAGEO; RK PN: RC0402JR-0710KL; Priority: A; Wattage: 1/16W; PCB Footprint: R0402; Value: 10K; Part Type: НЁУГєсД¤µзЧи; Manufacturer PN: RC0402JR-0710KL; Created by: YTL
R5514 = RESISTOR_Dup1: НЁУГєсД¤µзЧи,2R2,+/-5%,R0402,1/16W.; Part Reference: R5514; Manufacturer PN: RC0402JR-072R2L; Manufacturer: YAGEO; Value: 2.2R; Wattage: 1/16W; Priority: A; PCB Footprint: R0402; Created by: YTL; Part Type: НЁУГєсД¤µзЧи; RK PN: RC0402JR-072R2L
R5515 = RESISTOR_Dup1: НЁУГєсД¤µзЧи,2R2,+/-5%,R0402,1/16W.; Part Reference: R5515; Manufacturer PN: RC0402JR-072R2L; Manufacturer: YAGEO; Value: 2.2R; Wattage: 1/16W; Priority: A; PCB Footprint: R0402; Created by: YTL; Part Type: НЁУГєсД¤µзЧи; RK PN: RC0402JR-072R2L
R5516 = RESISTOR_Dup1: НЁУГєсД¤µзЧи,2R2,+/-5%,R0402,1/16W.; Part Reference: R5516; Manufacturer PN: RC0402JR-072R2L; Manufacturer: YAGEO; Value: 2.2R; Wattage: 1/16W; Priority: A; PCB Footprint: R0402; Created by: YTL; Part Type: НЁУГєсД¤µзЧи; RK PN: RC0402JR-072R2L
R5517 = RESISTOR_Dup1: НЁУГєсД¤µзЧи,2R2,+/-5%,R0402,1/16W.; Part Reference: R5517; Manufacturer PN: RC0402JR-072R2L; Manufacturer: YAGEO; Value: 2.2R; Wattage: 1/16W; Priority: A; PCB Footprint: R0402; Created by: YTL; Part Type: НЁУГєсД¤µзЧи; RK PN: RC0402JR-072R2L
R5518 = RESISTOR_Dup1: НЁУГєсД¤µзЧи,2R2,+/-5%,R0402,1/16W.; Part Reference: R5518; Manufacturer PN: RC0402JR-072R2L; Manufacturer: YAGEO; Value: 2.2R; Wattage: 1/16W; Priority: A; PCB Footprint: R0402; Created by: YTL; Part Type: НЁУГєсД¤µзЧи; RK PN: RC0402JR-072R2L
R5519 = RESISTOR_Dup1: НЁУГєсД¤µзЧи,2R2,+/-5%,R0402,1/16W.; Part Reference: R5519; Manufacturer PN: RC0402JR-072R2L; Manufacturer: YAGEO; Value: 2.2R; Wattage: 1/16W; Priority: A; PCB Footprint: R0402; Created by: YTL; Part Type: НЁУГєсД¤µзЧи; RK PN: RC0402JR-072R2L
R5520 = RESISTOR_Dup1: НЁУГєсД¤µзЧи,0R,+/-5%,R0201,1/20W.; Part Reference: R5520; Manufacturer: YAGEO; RK PN: RC0201JR-070RL; Priority: A; Wattage: 1/20W; Value: 0R; Part Type: НЁУГєсД¤µзЧи; Manufacturer PN: RC0201JR-070RL; Created by: YTL
R5521 = RESISTOR_Dup1: НЁУГєсД¤µзЧи,0R,+/-5%,R0201,1/20W.; Part Reference: R5521; Manufacturer: YAGEO; RK PN: RC0201JR-070RL; Priority: A; Wattage: 1/20W; Value: 0R; Part Type: НЁУГєсД¤µзЧи; Manufacturer PN: RC0201JR-070RL; Created by: YTL
R5522 = RESISTOR_Dup1: НЁУГєсД¤µзЧи,2R2,+/-5%,R0402,1/16W.; Part Reference: R5522; Manufacturer: YAGEO; Value: 2.2R; RK PN: RC0402JR-072R2L; Priority: A; Wattage: 1/16W; PCB Footprint: R0402; Part Type: НЁУГєсД¤µзЧи; Manufacturer PN: RC0402JR-072R2L; Created by: YTL
R5523 = RESISTOR_Dup1: НЁУГєсД¤µзЧи,0R,+/-5%,R0201,1/20W.; Part Reference: R5523; Manufacturer: YAGEO; RK PN: RC0201JR-070RL; Priority: A; Wattage: 1/20W; Value: 0R; Part Type: НЁУГєсД¤µзЧи; Manufacturer PN: RC0201JR-070RL; Created by: YTL
R5524 = RESISTOR_Dup1: НЁУГєсД¤µзЧи,0R,+/-5%,R0201,1/20W.; Part Reference: R5524; Manufacturer: YAGEO; RK PN: RC0201JR-070RL; Priority: A; Wattage: 1/20W; Value: 0R; Part Type: НЁУГєсД¤µзЧи; Manufacturer PN: RC0201JR-070RL; Created by: YTL
R5525 = RESISTOR_Dup1: НЁУГєсД¤µзЧи,0R,+/-5%,R0201,1/20W.; Part Reference: R5525; Manufacturer: YAGEO; RK PN: RC0201JR-070RL; Priority: A; Wattage: 1/20W; Value: 0R; Part Type: НЁУГєсД¤µзЧи; Manufacturer PN: RC0201JR-070RL; Created by: YTL
R5526 = RESISTOR_Dup1: НЁУГєсД¤µзЧи,0R,+/-5%,R0201,1/20W.; Part Reference: R5526; Manufacturer: YAGEO; RK PN: RC0201JR-070RL; Priority: A; Wattage: 1/20W; Value: 0R; Part Type: НЁУГєсД¤µзЧи; Manufacturer PN: RC0201JR-070RL; Created by: YTL
R5527 = RESISTOR_Dup1: НЁУГєсД¤µзЧи,0R,+/-5%,R0201,1/20W.; Part Reference: R5527; Manufacturer: YAGEO; RK PN: RC0201JR-070RL; Priority: A; Wattage: 1/20W; Value: 0R; Part Type: НЁУГєсД¤µзЧи; Manufacturer PN: RC0201JR-070RL; Created by: YTL
R5528 = RESISTOR_Dup1: НЁУГєсД¤µзЧи,22R,+/-5%,R0402,1/16W.; Part Reference: R5528; Manufacturer PN: RC0402JR-0722RL; Manufacturer: YAGEO; Wattage: 1/16W; Priority: A; PCB Footprint: R0402; Value: 22R; Created by: YTL; Part Type: НЁУГєсД¤µзЧи; RK PN: RC0402JR-0722RL
R5529 = RESISTOR_Dup1: НЁУГєсД¤µзЧи,0R,+/-5%,R0201,1/20W.; Part Reference: R5529; Manufacturer: YAGEO; RK PN: RC0201JR-070RL; Priority: A; Wattage: 1/20W; Value: 0R; Part Type: НЁУГєсД¤µзЧи; Manufacturer PN: RC0201JR-070RL; Created by: YTL
R5530 = RESISTOR_Dup1: НЁУГєсД¤µзЧи,0R,+/-5%,R0201,1/20W.; Part Reference: R5530; Manufacturer: YAGEO; RK PN: RC0201JR-070RL; Priority: A; Wattage: 1/20W; Value: 0R; Part Type: НЁУГєсД¤µзЧи; Manufacturer PN: RC0201JR-070RL; Created by: YTL
R5531 = RESISTOR_Dup1: НЁУГєсД¤µзЧи,5K6,+/-1%,R0402,1/16W.; Part Reference: R5531; Manufacturer: YAGEO; Value: 5.6K; RK PN: RC0402FR-075K6L; Priority: A; Wattage: 1/16W; PCB Footprint: R0402; Part Type: НЁУГєсД¤µзЧи; Manufacturer PN: RC0402FR-075K6L; Created by: YTL
R5532 = RESISTOR_Dup1: НЁУГєсД¤µзЧи,0R,+/-5%,R0201,1/20W.; Part Reference: R5532; Manufacturer: YAGEO; RK PN: RC0201JR-070RL; Priority: A; Wattage: 1/20W; Value: 0R; Part Type: НЁУГєсД¤µзЧи; Manufacturer PN: RC0201JR-070RL; Created by: YTL
R5533 = RESISTOR_Dup1: НЁУГєсД¤µзЧи,47K,+/-5%,R0402,1/16W.; Part Reference: R5533; Manufacturer PN: RC0402JR-0747KL; Manufacturer: YAGEO; Wattage: 1/16W; Priority: A; PCB Footprint: R0402; Value: 47K; Created by: YTL; Part Type: НЁУГєсД¤µзЧи; RK PN: RC0402JR-0747KL
R5534 = RESISTOR_Dup1: НЁУГєсД¤µзЧи,100K,+/-5%,R0402,1/16W.; Part Reference: R5534; Manufacturer PN: RC0402JR-07100KL; Manufacturer: YAGEO; Wattage: 1/16W; Priority: A; PCB Footprint: R0402; Value: 100K; Created by: YTL; Part Type: НЁУГєсД¤µзЧи; RK PN: RC0402JR-07100KL
R5535 = RESISTOR_Dup1: НЁУГєсД¤µзЧи,100K,+/-5%,R0402,1/16W.; Part Reference: R5535; Manufacturer PN: RC0402JR-07100KL; Manufacturer: YAGEO; Wattage: 1/16W; Priority: A; PCB Footprint: R0402; Value: 100K; Created by: YTL; Part Type: НЁУГєсД¤µзЧи; RK PN: RC0402JR-07100KL
R5536 = RESISTOR_Dup1: НЁУГєсД¤µзЧи,100K,+/-5%,R0402,1/16W.; Part Reference: R5536; Manufacturer PN: RC0402JR-07100KL; Manufacturer: YAGEO; Wattage: 1/16W; Priority: A; PCB Footprint: R0402; Value: 100K; Created by: YTL; Part Type: НЁУГєсД¤µзЧи; RK PN: RC0402JR-07100KL
R5537 = RESISTOR_Dup1: НЁУГєсД¤µзЧи,100K,+/-5%,R0402,1/16W.; Part Reference: R5537; Manufacturer PN: RC0402JR-07100KL; Manufacturer: YAGEO; Wattage: 1/16W; Priority: A; PCB Footprint: R0402; Value: 100K; Created by: YTL; Part Type: НЁУГєсД¤µзЧи; RK PN: RC0402JR-07100KL
R5538 = RESISTOR_Dup1: НЁУГєсД¤µзЧи,33R,+/-5%,R0402,1/16W.; Part Reference: R5538; Manufacturer: YAGEO; RK PN: RC0402JR-0733RL; Priority: A; Wattage: 1/16W; PCB Footprint: R0402; Value: 33R; Part Type: НЁУГєсД¤µзЧи; Manufacturer PN: RC0402JR-0733RL; Created by: YTL
R5539 = RESISTOR_Dup1: НЁУГєсД¤µзЧи,100K,+/-5%,R0402,1/16W.; Part Reference: R5539; Manufacturer PN: RC0402JR-07100KL; Manufacturer: YAGEO; Wattage: 1/16W; Priority: A; PCB Footprint: R0402; Value: 100K; Created by: YTL; Part Type: НЁУГєсД¤µзЧи; RK PN: RC0402JR-07100KL
R5540 = RESISTOR_Dup1: НЁУГєсД¤µзЧи,0R,+/-5%,R0402,1/16W.; Part Reference: R5540; Manufacturer PN: RC0402JR-070RL; Manufacturer: YAGEO; Wattage: 1/16W; Priority: A; PCB Footprint: R0402; Value: 0R; Created by: YTL; Part Type: НЁУГєсД¤µзЧи; RK PN: RC0402JR-070RL
R5541 = RESISTOR_Dup1: НЁУГєсД¤µзЧи,100K,+/-5%,R0402,1/16W.; Part Reference: R5541; Manufacturer PN: RC0402JR-07100KL; Manufacturer: YAGEO; Wattage: 1/16W; Priority: A; PCB Footprint: R0402; Value: 100K; Created by: YTL; Part Type: НЁУГєсД¤µзЧи; RK PN: RC0402JR-07100KL
R5542 = RESISTOR_Dup1: НЁУГєсД¤µзЧи,10K,+/-5%,R0402,1/16W.; Part Reference: R5542; Manufacturer PN: RC0402JR-0710KL; Manufacturer: YAGEO; Wattage: 1/16W; Priority: A; PCB Footprint: R0402; Value: 10K; Created by: YTL; Part Type: НЁУГєсД¤µзЧи; RK PN: RC0402JR-0710KL
R5543 = RESISTOR_Dup1: НЁУГєсД¤µзЧи,1K8,+/-5%,R0402,1/16W.; Part Reference: R5543; Manufacturer: YAGEO; Value: 1.8K; RK PN: RC0402JR-071K8L; Priority: A; Wattage: 1/16W; PCB Footprint: R0402; Part Type: НЁУГєсД¤µзЧи; Manufacturer PN: RC0402JR-071K8L; Created by: YTL
R5544 = RESISTOR_Dup1: НЁУГєсД¤µзЧи,22R,+/-5%,R0402,1/16W.; Part Reference: R5544; Manufacturer PN: RC0402JR-0722RL; Manufacturer: YAGEO; Wattage: 1/16W; Priority: A; PCB Footprint: R0402; Value: 22R; Created by: YTL; Part Type: НЁУГєсД¤µзЧи; RK PN: RC0402JR-0722RL
R5545 = RESISTOR_Dup1: НЁУГєсД¤µзЧи,100K,+/-5%,R0402,1/16W.; Part Reference: R5545; Manufacturer PN: RC0402JR-07100KL; Manufacturer: YAGEO; Wattage: 1/16W; Priority: A; PCB Footprint: R0402; Value: 100K; Created by: YTL; Part Type: НЁУГєсД¤µзЧи; RK PN: RC0402JR-07100KL
R5546 = RESISTOR_Dup1: НЁУГєсД¤µзЧи,10K,+/-5%,R0402,1/16W.; Part Reference: R5546; Manufacturer PN: RC0402JR-0710KL; Manufacturer: YAGEO; Wattage: 1/16W; Priority: A; PCB Footprint: R0402; Value: 10K; Created by: YTL; Part Type: НЁУГєсД¤µзЧи; RK PN: RC0402JR-0710KL
R5547 = RESISTOR_Dup1: НЁУГєсД¤µзЧи,10K,+/-5%,R0402,1/16W.; Part Reference: R5547; Manufacturer PN: RC0402JR-0710KL; Manufacturer: YAGEO; Wattage: 1/16W; Priority: A; PCB Footprint: R0402; Value: 10K; Created by: YTL; Part Type: НЁУГєсД¤µзЧи; RK PN: RC0402JR-0710KL
R5548 = RESISTOR_Dup1: НЁУГєсД¤µзЧи,1K8,+/-5%,R0402,1/16W.; Part Reference: R5548; Manufacturer: YAGEO; Value: 1.8K; RK PN: RC0402JR-071K8L; Priority: A; Wattage: 1/16W; PCB Footprint: R0402; Part Type: НЁУГєсД¤µзЧи; Manufacturer PN: RC0402JR-071K8L; Created by: YTL
R5549 = RESISTOR_Dup1: НЁУГєсД¤µзЧи,10K,+/-5%,R0402,1/16W.; Part Reference: R5549; Manufacturer PN: RC0402JR-0710KL; Manufacturer: YAGEO; Wattage: 1/16W; Priority: A; PCB Footprint: R0402; Value: 10K; Created by: YTL; Part Type: НЁУГєсД¤µзЧи; RK PN: RC0402JR-0710KL
R5550 = RESISTOR_Dup1: НЁУГєсД¤µзЧи,22R,+/-5%,R0402,1/16W.; Part Reference: R5550; Manufacturer PN: RC0402JR-0722RL; Manufacturer: YAGEO; Wattage: 1/16W; Priority: A; PCB Footprint: R0402; Value: 22R; Created by: YTL; Part Type: НЁУГєсД¤µзЧи; RK PN: RC0402JR-0722RL
R5551 = RESISTOR_Dup1: НЁУГєсД¤µзЧи,51K,+/-5%,R0402,1/16W.; Part Reference: R5551; Manufacturer PN: RC0402JR-0751KL; Manufacturer: YAGEO; Wattage: 1/16W; Priority: A; PCB Footprint: R0402; Value: 51K; Created by: YTL; Part Type: НЁУГєсД¤µзЧи; RK PN: RC0402JR-0751KL
R5552 = RESISTOR_Dup1: НЁУГєсД¤µзЧи,10K,+/-5%,R0402,1/16W.; Part Reference: R5552; Manufacturer: YAGEO; RK PN: RC0402JR-0710KL; Priority: A; Wattage: 1/16W; PCB Footprint: R0402; Value: 10K; Part Type: НЁУГєсД¤µзЧи; Manufacturer PN: RC0402JR-0710KL; Created by: YTL
R5553 = RESISTOR_Dup1: НЁУГєсД¤µзЧи,100K,+/-1%,R0402,1/16W.; Part Reference: R5553; Manufacturer: YAGEO; RK PN: RC0402FR-07100KL; Priority: A; Wattage: 1/16W; PCB Footprint: R0402; Value: 100K; Part Type: НЁУГєсД¤µзЧи; Manufacturer PN: RC0402FR-07100KL; Created by: YTL
R5554 = RESISTOR_Dup1: НЁУГєсД¤µзЧи,100K,+/-1%,R0402,1/16W.; Part Reference: R5554; Manufacturer: YAGEO; RK PN: RC0402FR-07100KL; Priority: A; Wattage: 1/16W; PCB Footprint: R0402; Value: 100K; Part Type: НЁУГєсД¤µзЧи; Manufacturer PN: RC0402FR-07100KL; Created by: YTL
R5556 = RESISTOR_Dup1: НЁУГєсД¤µзЧи,10K,+/-5%,R0402,1/16W.; Part Reference: R5556; Manufacturer: YAGEO; RK PN: RC0402JR-0710KL; Priority: A; Wattage: 1/16W; PCB Footprint: R0402; Value: 10K; Part Type: НЁУГєсД¤µзЧи; Manufacturer PN: RC0402JR-0710KL; Created by: YTL
TP5500 = TP: Test Point 0.7mm; Part Reference: TP5500; PCB Footprint: TP_0R70; Value: TP_0.7; Priority: A; RK PN: TESTPOINT_0R7; Created by: JJJ; Part Type: TP
U5500 = IT6161: Part Reference: U5500; Value: IT6161
U5501 = DCDC_SY8088: High Efficiency 5.5V, 2A continuous, 3A peak, 1MHz Synchronous Step Down Regulator; Part Reference: U5501; Manufacturer PN: SY8089AAC; Manufacturer: SilergyЈЁОщБ¦ЅЬЈ©; Value: ETA3409/SY8089AAC; Priority: A; PCB Footprint: SOT_23_5; Created by: JJJ; Part Type: DCDC; RK PN: SY8089AAC